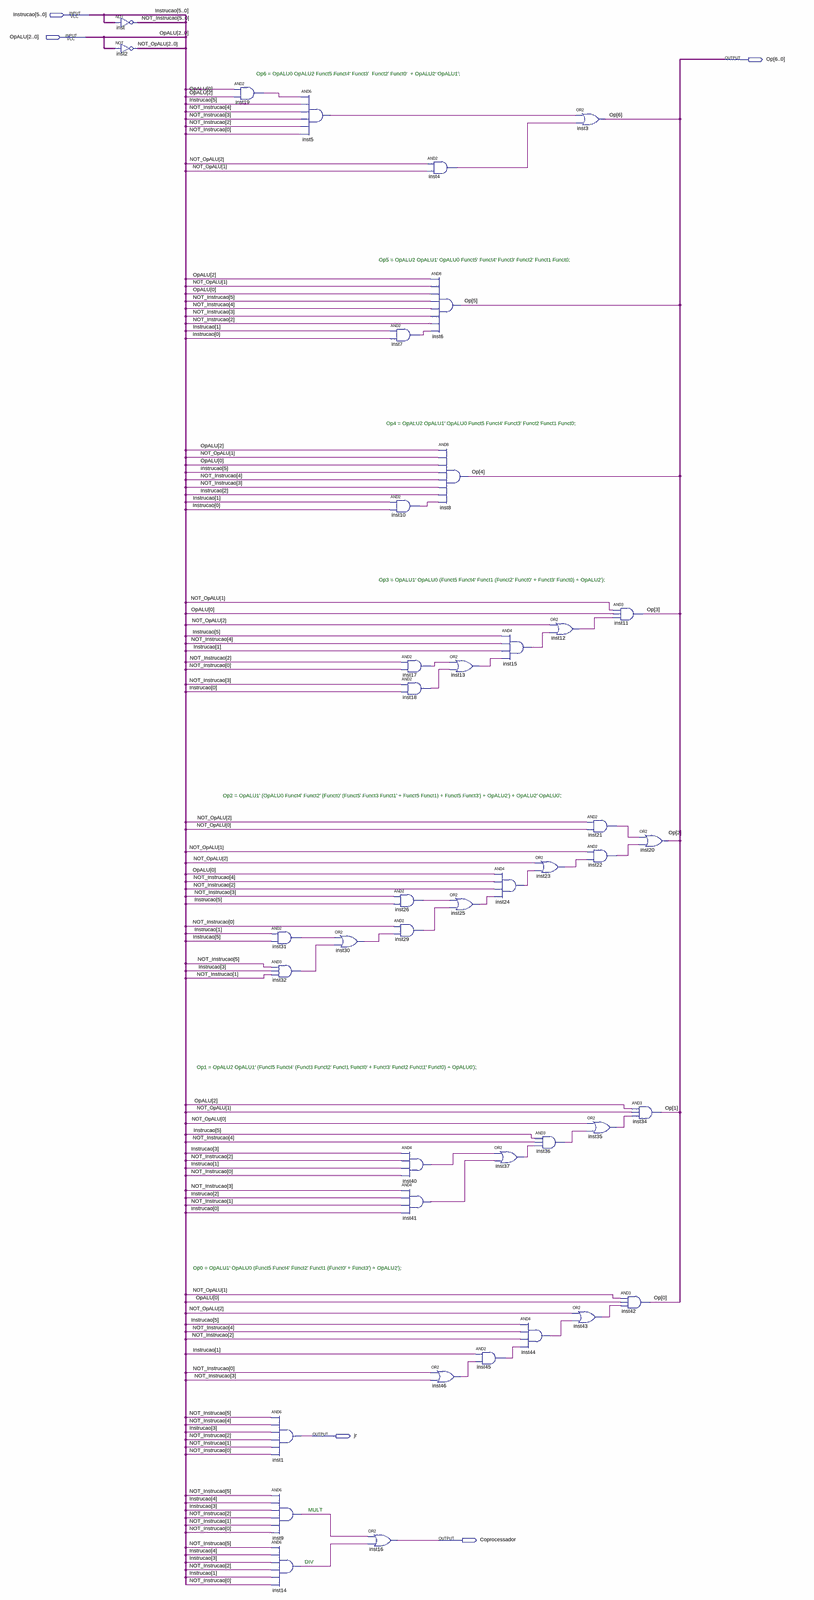
[diagram p0: schematic sheet, whole]
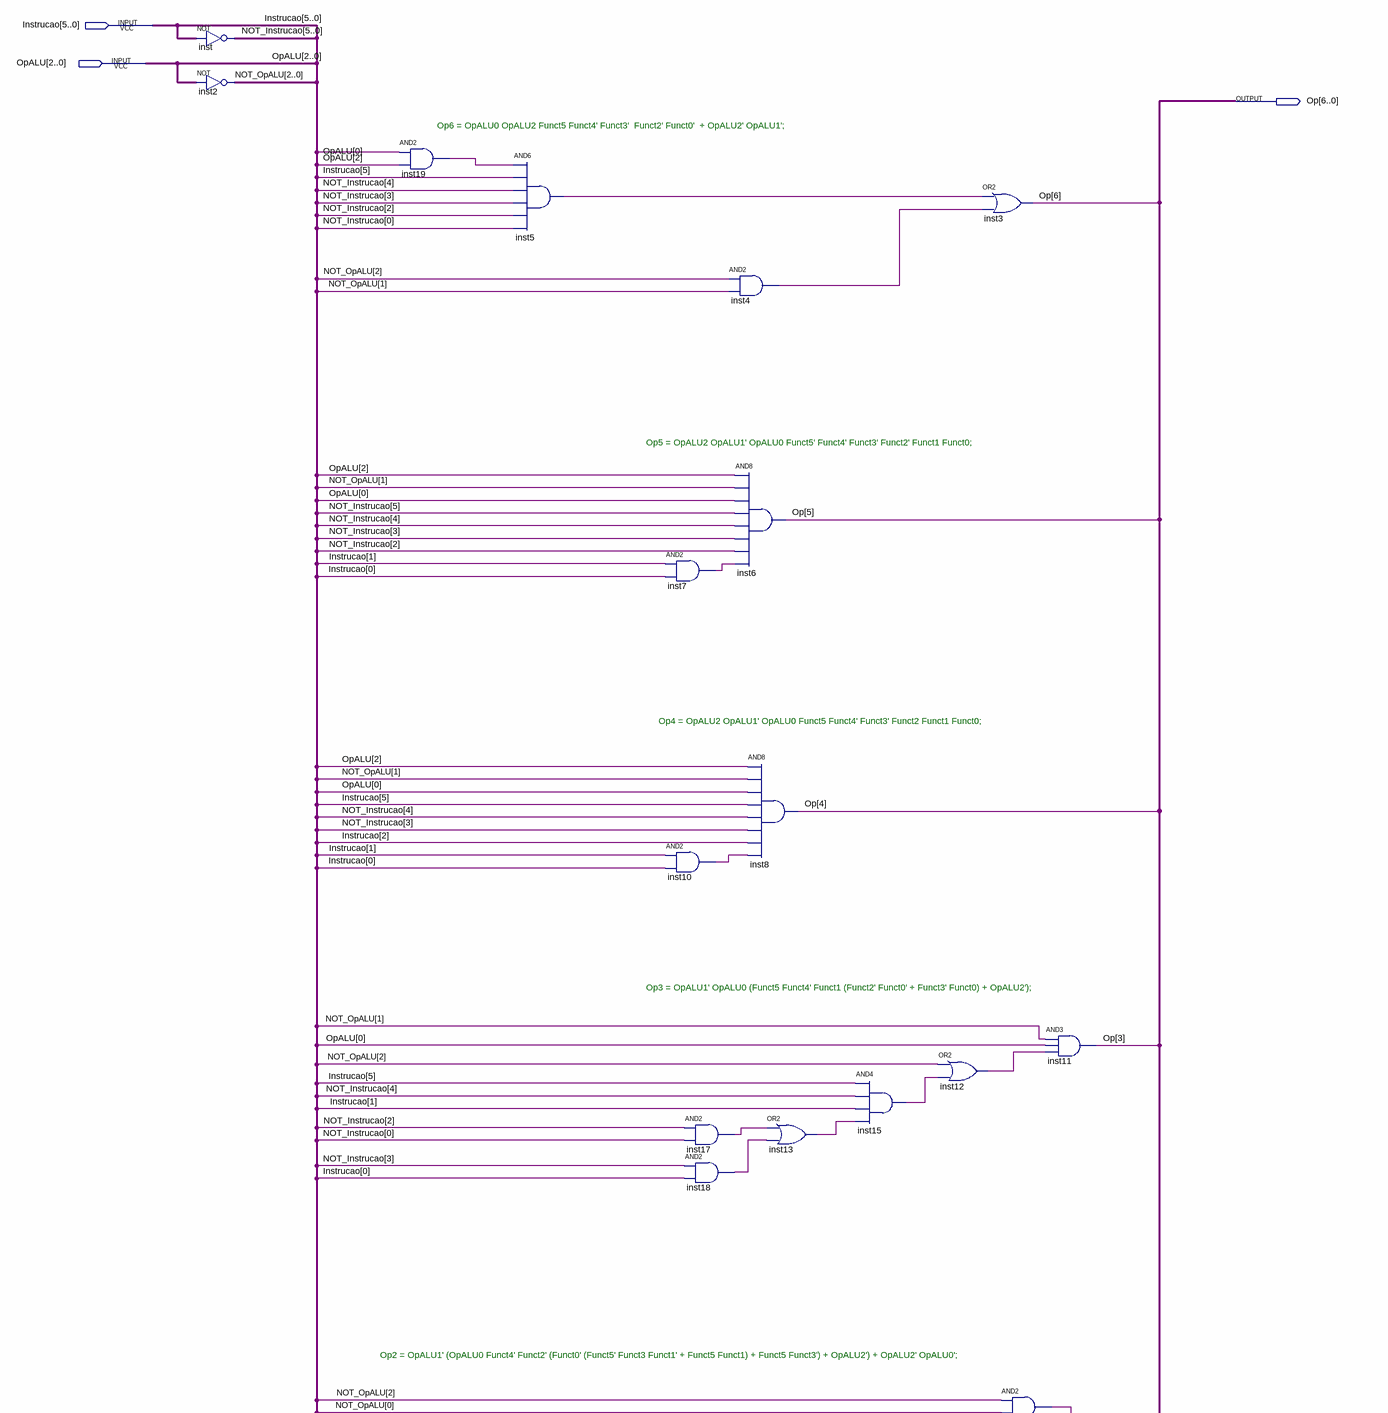
[diagram p1: schematic sheet, upper part]
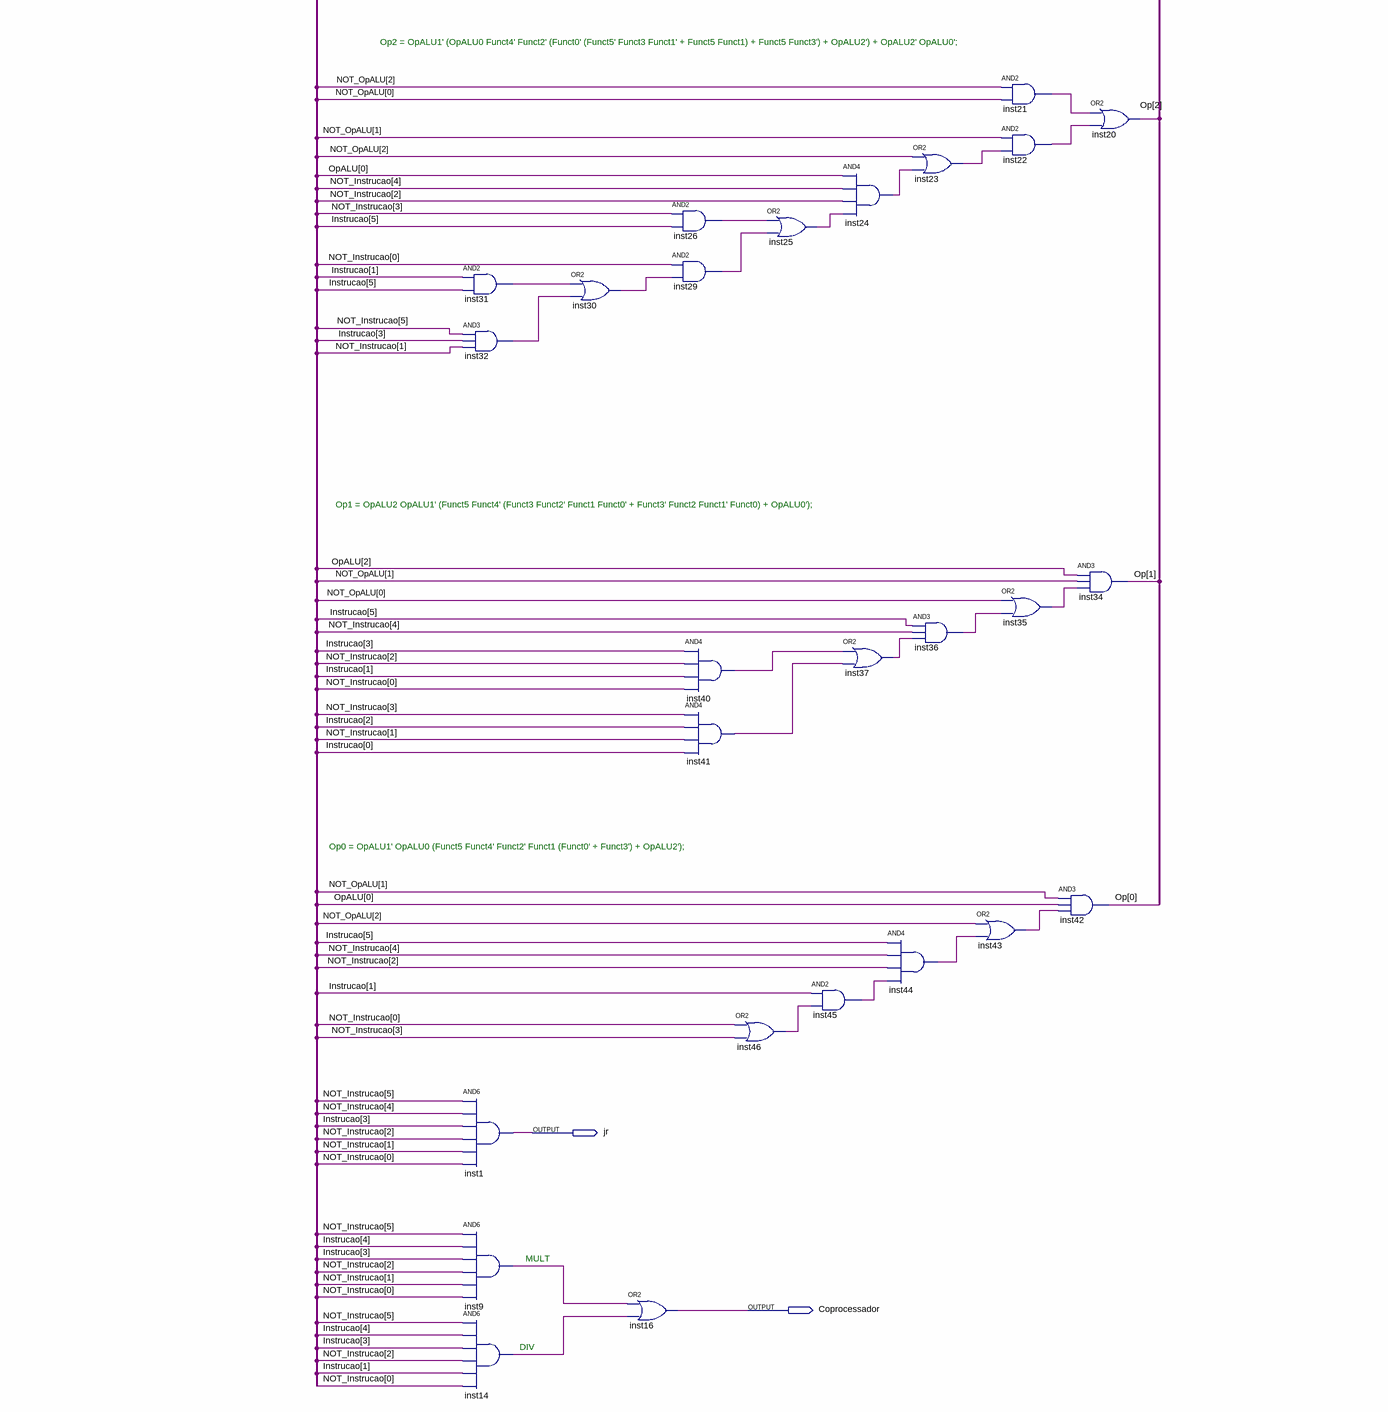
[diagram p2: schematic sheet, lower part]
// Quartus schematic Controle_ALU.bdf as structural Verilog: 42 symbols, 5 pins
module Controle_ALU (
  input  [5:0] Instrucao,
  input  [2:0] OpALU,
  output [6:0] Op,
  output jr,
  output Coprocessador
);

  wire inst4_out, inst5_out, inst7_out, inst9_out, inst10_out, inst12_out, inst13_out, inst14_out,
       inst15_out, inst17_out, inst18_out, inst19_out, inst21_out, inst22_out, inst23_out, inst24_out,
       inst25_out, inst26_out, inst29_out, inst30_out, inst31_out, inst32_out, inst35_out, inst36_out,
       inst37_out, inst40_out, inst41_out, inst43_out, inst44_out, inst45_out, inst46_out;
  wire [2:0] NOT_OpALU;
  wire [5:0] NOT_Instrucao;

  assign NOT_Instrucao = ~Instrucao;  // NOT inst, 6 bits wide
  assign NOT_OpALU = ~OpALU;  // NOT inst2, 3 bits wide
  and inst19 (inst19_out, OpALU[0], OpALU[2]);
  and inst31 (inst31_out, Instrucao[1], Instrucao[5]);
  and inst32 (inst32_out, NOT_Instrucao[5], Instrucao[3], NOT_Instrucao[1]);
  and inst1 (jr, NOT_Instrucao[5], NOT_Instrucao[4], Instrucao[3], NOT_Instrucao[2], NOT_Instrucao[1], NOT_Instrucao[0]);
  and inst9 (inst9_out, NOT_Instrucao[5], Instrucao[4], Instrucao[3], NOT_Instrucao[2], NOT_Instrucao[1], NOT_Instrucao[0]);
  and inst14 (inst14_out, NOT_Instrucao[5], Instrucao[4], Instrucao[3], NOT_Instrucao[2], Instrucao[1], NOT_Instrucao[0]);
  and inst5 (inst5_out, inst19_out, Instrucao[5], NOT_Instrucao[4], NOT_Instrucao[3], NOT_Instrucao[2], NOT_Instrucao[0]);
  or inst30 (inst30_out, inst31_out, inst32_out);
  or inst16 (Coprocessador, inst9_out, inst14_out);
  and inst7 (inst7_out, Instrucao[1], Instrucao[0]);
  and inst10 (inst10_out, Instrucao[1], Instrucao[0]);
  and inst17 (inst17_out, NOT_Instrucao[2], NOT_Instrucao[0]);
  and inst18 (inst18_out, NOT_Instrucao[3], Instrucao[0]);
  and inst26 (inst26_out, NOT_Instrucao[3], Instrucao[5]);
  and inst29 (inst29_out, NOT_Instrucao[0], inst30_out);
  and inst40 (inst40_out, Instrucao[3], NOT_Instrucao[2], Instrucao[1], NOT_Instrucao[0]);
  and inst41 (inst41_out, NOT_Instrucao[3], Instrucao[2], NOT_Instrucao[1], Instrucao[0]);
  and inst4 (inst4_out, NOT_OpALU[2], NOT_OpALU[1]);
  and inst6 (Op[5], OpALU[2], NOT_OpALU[1], OpALU[0], NOT_Instrucao[5], NOT_Instrucao[4], NOT_Instrucao[3], NOT_Instrucao[2], inst7_out);
  or inst46 (inst46_out, NOT_Instrucao[0], NOT_Instrucao[3]);
  and inst8 (Op[4], OpALU[2], NOT_OpALU[1], OpALU[0], Instrucao[5], NOT_Instrucao[4], NOT_Instrucao[3], Instrucao[2], inst10_out);
  or inst13 (inst13_out, inst17_out, inst18_out);
  or inst25 (inst25_out, inst26_out, inst29_out);
  and inst24 (inst24_out, OpALU[0], NOT_Instrucao[4], NOT_Instrucao[2], inst25_out);
  or inst37 (inst37_out, inst40_out, inst41_out);
  and inst45 (inst45_out, Instrucao[1], inst46_out);
  and inst15 (inst15_out, Instrucao[5], NOT_Instrucao[4], Instrucao[1], inst13_out);
  and inst44 (inst44_out, Instrucao[5], NOT_Instrucao[4], NOT_Instrucao[2], inst45_out);
  or inst12 (inst12_out, NOT_OpALU[2], inst15_out);
  or inst23 (inst23_out, NOT_OpALU[2], inst24_out);
  and inst36 (inst36_out, Instrucao[5], NOT_Instrucao[4], inst37_out);
  or inst3 (Op[6], inst5_out, inst4_out);
  or inst43 (inst43_out, NOT_OpALU[2], inst44_out);
  and inst11 (Op[3], NOT_OpALU[1], OpALU[0], inst12_out);
  and inst21 (inst21_out, NOT_OpALU[2], NOT_OpALU[0]);
  and inst22 (inst22_out, NOT_OpALU[1], inst23_out);
  or inst35 (inst35_out, NOT_OpALU[0], inst36_out);
  or inst20 (Op[2], inst21_out, inst22_out);
  and inst34 (Op[1], OpALU[2], NOT_OpALU[1], inst35_out);
  and inst42 (Op[0], NOT_OpALU[1], OpALU[0], inst43_out);

  // Notes on the sheet:
  //   Op6 = OpALU0 OpALU2 Funct5 Funct4' Funct3'  Funct2' Funct0'  + OpALU2' OpALU1';
  //   Op5 = OpALU2 OpALU1' OpALU0 Funct5' Funct4' Funct3' Funct2' Funct1 Funct0;
  //   Op4 = OpALU2 OpALU1' OpALU0 Funct5 Funct4' Funct3' Funct2 Funct1 Funct0;
  //   Op3 = OpALU1' OpALU0 (Funct5 Funct4' Funct1 (Funct2' Funct0' + Funct3' Funct0) + OpALU2');
  //   Op2 = OpALU1' (OpALU0 Funct4' Funct2' (Funct0' (Funct5' Funct3 Funct1' + Funct5 Funct1) + Funct5 Funct3') + OpALU2') + OpALU2' OpALU0';
  //   Op1 = OpALU2 OpALU1' (Funct5 Funct4' (Funct3 Funct2' Funct1 Funct0' + Funct3' Funct2 Funct1' Funct0) + OpALU0');
  //   Op0 = OpALU1' OpALU0 (Funct5 Funct4' Funct2' Funct1 (Funct0' + Funct3') + OpALU2');
  //   MULT
  //   DIV
endmodule
